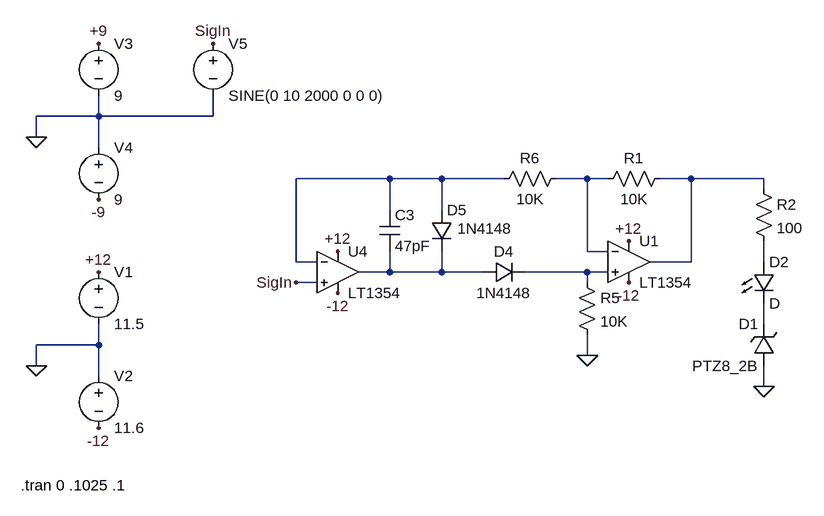
[diagram p0: schematic clip_detector2.asc]
clip_detector2.asc, the LTspice schematic file:
Version 4
SHEET 1 1348 1044
WIRE -304 224 -304 192
WIRE -304 224 -400 224
WIRE -128 224 -128 192
WIRE -128 224 -304 224
WIRE -400 256 -400 224
WIRE -304 272 -304 224
WIRE 144 320 0 320
WIRE 224 320 144 320
WIRE 320 320 224 320
WIRE 448 320 400 320
WIRE 480 320 448 320
WIRE 608 320 560 320
WIRE 720 320 608 320
WIRE 720 336 720 320
WIRE 144 368 144 320
WIRE 224 368 224 320
WIRE 448 432 448 320
WIRE 480 432 448 432
WIRE 0 448 0 320
WIRE 32 448 0 448
WIRE 608 448 608 320
WIRE 608 448 544 448
WIRE 720 448 720 416
WIRE 144 464 144 432
WIRE 144 464 96 464
WIRE 224 464 224 432
WIRE 224 464 144 464
WIRE 288 464 224 464
WIRE 448 464 352 464
WIRE 480 464 448 464
WIRE 32 480 0 480
WIRE 448 480 448 464
WIRE 720 544 720 512
WIRE -304 576 -304 544
WIRE -304 576 -400 576
WIRE 448 592 448 560
WIRE -400 608 -400 576
WIRE -304 624 -304 576
WIRE 720 640 720 608
FLAG -400 608 0
FLAG -304 464 +12
FLAG -304 704 -12
FLAG -400 256 0
FLAG -304 112 +9
FLAG -304 352 -9
FLAG -128 112 SigIn
FLAG 0 480 SigIn
FLAG 512 416 +12
FLAG 512 480 -12
FLAG 448 592 0
FLAG 64 432 +12
FLAG 64 496 -12
FLAG 720 640 0
SYMBOL voltage -304 448 R0
WINDOW 123 0 0 Left 0
WINDOW 39 0 0 Left 0
SYMATTR InstName V1
SYMATTR Value 11.5
SYMBOL voltage -304 608 R0
WINDOW 123 0 0 Left 0
WINDOW 39 0 0 Left 0
SYMATTR InstName V2
SYMATTR Value 11.6
SYMBOL voltage -304 96 R0
WINDOW 123 0 0 Left 0
WINDOW 39 0 0 Left 0
SYMATTR InstName V3
SYMATTR Value 9
SYMBOL voltage -304 256 R0
WINDOW 123 0 0 Left 0
WINDOW 39 0 0 Left 0
SYMATTR InstName V4
SYMATTR Value 9
SYMBOL voltage -128 96 R0
WINDOW 123 0 0 Left 0
WINDOW 39 0 0 Left 0
SYMATTR InstName V5
SYMATTR Value SINE(0 10 2000 0 0 0)
SYMBOL LED 704 448 R0
SYMATTR InstName D2
SYMBOL res 704 320 R0
SYMATTR InstName R2
SYMATTR Value 100
SYMBOL diode 288 480 R270
WINDOW 0 32 32 VTop 2
WINDOW 3 0 32 VBottom 2
SYMATTR InstName D4
SYMATTR Value 1N4148
SYMBOL diode 208 368 R0
WINDOW 3 40 29 Left 2
SYMATTR InstName D5
SYMATTR Value 1N4148
SYMBOL OpAmps\\LT1354 512 384 R0
SYMATTR InstName U1
SYMBOL res 464 336 R270
WINDOW 0 32 56 VTop 2
WINDOW 3 0 56 VBottom 2
SYMATTR InstName R1
SYMATTR Value 10K
SYMBOL res 432 464 R0
SYMATTR InstName R5
SYMATTR Value 10K
SYMBOL OpAmps\\LT1354 64 400 R0
SYMATTR InstName U4
SYMBOL cap 128 368 R0
SYMATTR InstName C3
SYMATTR Value 47pF
SYMBOL res 304 336 R270
WINDOW 0 32 56 VTop 2
WINDOW 3 0 56 VBottom 2
SYMATTR InstName R6
SYMATTR Value 10K
SYMBOL zener 736 608 R180
WINDOW 0 24 64 Left 2
WINDOW 3 24 0 Left 2
SYMATTR InstName D1
SYMATTR Value PTZ8_2B
TEXT -424 792 Left 2 !.tran 0 .1025 .1

The netlist it stands for:
* clip_detector2.asc
V1 +12 0 11.5
V2 0 -12 11.6
V3 +9 0 9
V4 0 -9 9
V5 SigIn 0 SINE(0 10 2000 0 0 0)
D2 N004 N007 D
R2 N003 N004 100
D4 N005 N006 1N4148
D5 N001 N005 1N4148
XU1 N006 N002 +12 -12 N003 LT1354  ; pins In+ In- V+ V- OUT
R1 N002 N003 10K
R5 N006 0 10K
XU4 SigIn N001 +12 -12 N005 LT1354  ; pins In+ In- V+ V- OUT
C3 N001 N005 47pF
R6 N001 N002 10K
D1 0 N007 PTZ8_2B
.model D D
.lib standard.dio
.tran 0 .1025 .1
.backanno
.end